# Altium schematic sheet Front.SchDoc
size A; SheetNumber: 1
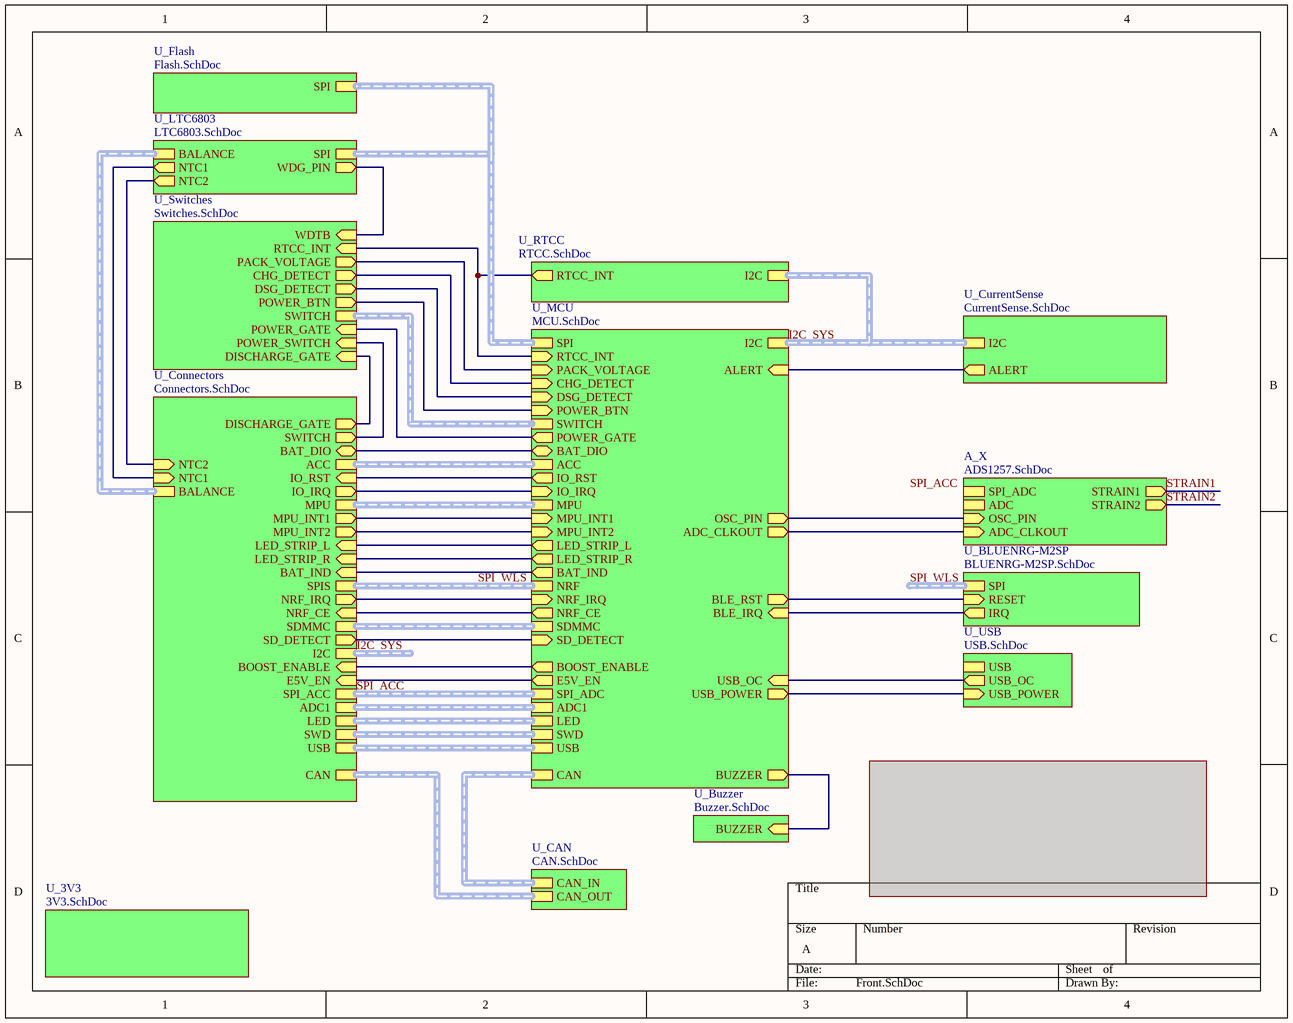
[diagram p0: Front.SchDoc]

## Sub-sheets
A_X = ADS1257.SchDoc: SPI_ADC (harness SPI_ADC), ADC (harness ADC), STRAIN1 (out), STRAIN2 (out), OSC_PIN (in), ADC_CLKOUT (in)
U_3V3 = 3V3.SchDoc: no entries
U_BLUENRG-M2SP = BLUENRG-M2SP.SchDoc: SPI (harness SPI), RESET (in), IRQ (out)
U_Buzzer = Buzzer.SchDoc: BUZZER (in)
U_CAN = CAN.SchDoc: CAN_IN (harness CAN Input), CAN_OUT (harness CAN Output)
U_Connectors = Connectors.SchDoc: SWITCH (out), CAN (harness CAN Output), NTC1 (in), BALANCE (harness Balance), MPU (harness I2C), MPU_INT1 (out), MPU_INT2 (out), LED_STRIP_L (in), LED_STRIP_R (in), SWD (harness SWD), LED (harness LED), IO_RST (in), IO_IRQ (out), NTC2 (in), SPIS (harness SPI), SDMMC (harness SDMMC), SD_DETECT (out), NRF_CE (in), NRF_IRQ (out), SPI_ACC (harness SPI_ADC), BAT_DIO (bidir), USB (harness USB), BAT_IND (in), DISCHARGE_GATE (out), ACC (harness I2C), BOOST_ENABLE (in), E5V_EN (in), I2C (harness I2C), ADC1 (harness ADC)
U_CurrentSense = CurrentSense.SchDoc: ALERT (out), I2C (harness I2C)
U_Flash = Flash.SchDoc: SPI (harness SPI)
U_LTC6803 = LTC6803.SchDoc: SPI (harness SPI), NTC1 (out), BALANCE (harness Balance), NTC2 (out), WDG_PIN (out)
U_MCU = MCU.SchDoc: CHG_DETECT (in), POWER_BTN (in), POWER_GATE (out), USB (harness USB), CAN (harness CAN Input), ACC (harness I2C), SWITCH (harness Switches), I2C (harness I2C), RTCC_INT (in), PACK_VOLTAGE (in), BUZZER (out), SPI_ADC (harness SPI_ADC), ADC1 (harness ADC), MPU (harness I2C), MPU_INT1 (in), MPU_INT2 (in), ALERT (in), SPI, LED_STRIP_L (out), LED_STRIP_R (out), SWD (harness SWD), LED (harness LED), IO_RST (out), IO_IRQ (in), BOOST_ENABLE (out), NRF (harness SPI), DSG_DETECT (in), SDMMC (harness SDMMC), USB_POWER (out), USB_OC (in), SD_DETECT (in), NRF_CE (out), NRF_IRQ (in), OSC_PIN (out), ADC_CLKOUT (out), BAT_DIO (bidir), BAT_IND (out), BLE_RST (out), BLE_IRQ (in), E5V_EN (out)
U_RTCC = RTCC.SchDoc: I2C (harness I2C), RTCC_INT (out)
U_Switches = Switches.SchDoc: POWER_GATE (in), POWER_BTN (out), CHG_DETECT (out), SWITCH (harness Switches), POWER_SWITCH (in), RTCC_INT (in), PACK_VOLTAGE (out), WDTB (in), DSG_DETECT (out), DISCHARGE_GATE (in)
U_USB = USB.SchDoc: USB_POWER (in), USB_OC (out), USB (harness USB)

## Nets
STRAIN1: sheet A_X/STRAIN1
STRAIN2: sheet A_X/STRAIN2
(unnamed): sheet U_MCU/CHG_DETECT, sheet U_Switches/CHG_DETECT
(unnamed): sheet U_MCU/POWER_BTN, sheet U_Switches/POWER_BTN
(unnamed): sheet U_MCU/POWER_GATE, sheet U_Switches/POWER_GATE
(unnamed): sheet U_MCU/RTCC_INT, sheet U_Switches/RTCC_INT, sheet U_RTCC/RTCC_INT
(unnamed): sheet U_MCU/PACK_VOLTAGE, sheet U_Switches/PACK_VOLTAGE
(unnamed): sheet U_MCU/BUZZER, sheet U_Buzzer/BUZZER
(unnamed): sheet U_MCU/MPU_INT1, sheet U_Connectors/MPU_INT1
(unnamed): sheet U_MCU/MPU_INT2, sheet U_Connectors/MPU_INT2
(unnamed): sheet U_MCU/ALERT, sheet U_CurrentSense/ALERT
(unnamed): sheet U_MCU/LED_STRIP_L, sheet U_Connectors/LED_STRIP_L
(unnamed): sheet U_MCU/LED_STRIP_R, sheet U_Connectors/LED_STRIP_R
(unnamed): sheet U_MCU/IO_RST, sheet U_Connectors/IO_RST
(unnamed): sheet U_MCU/IO_IRQ, sheet U_Connectors/IO_IRQ
(unnamed): sheet U_MCU/BOOST_ENABLE, sheet U_Connectors/BOOST_ENABLE
(unnamed): sheet U_MCU/DSG_DETECT, sheet U_Switches/DSG_DETECT
(unnamed): sheet U_MCU/USB_POWER, sheet U_USB/USB_POWER
(unnamed): sheet U_MCU/USB_OC, sheet U_USB/USB_OC
(unnamed): sheet U_MCU/SD_DETECT, sheet U_Connectors/SD_DETECT
(unnamed): sheet U_MCU/NRF_CE, sheet U_Connectors/NRF_CE
(unnamed): sheet U_MCU/NRF_IRQ, sheet U_Connectors/NRF_IRQ
(unnamed): sheet U_MCU/OSC_PIN, sheet A_X/OSC_PIN
(unnamed): sheet U_MCU/ADC_CLKOUT, sheet A_X/ADC_CLKOUT
(unnamed): sheet U_MCU/BAT_DIO, sheet U_Connectors/BAT_DIO
(unnamed): sheet U_MCU/BAT_IND, sheet U_Connectors/BAT_IND
(unnamed): sheet U_MCU/BLE_RST, sheet U_BLUENRG-M2SP/RESET
(unnamed): sheet U_MCU/BLE_IRQ, sheet U_BLUENRG-M2SP/IRQ
(unnamed): sheet U_MCU/E5V_EN, sheet U_Connectors/E5V_EN
(unnamed): sheet U_Switches/POWER_SWITCH, sheet U_Connectors/SWITCH
(unnamed): sheet U_Switches/WDTB, sheet U_LTC6803/WDG_PIN
(unnamed): sheet U_Switches/DISCHARGE_GATE, sheet U_Connectors/DISCHARGE_GATE
(unnamed): sheet U_Connectors/NTC1, sheet U_LTC6803/NTC1
(unnamed): sheet U_Connectors/NTC2, sheet U_LTC6803/NTC2

## Buses and harness runs
harness I2C_SYS = sheet U_Connectors/I2C
harness I2C_SYS = sheet U_CurrentSense/I2C = sheet U_MCU/I2C = sheet U_RTCC/I2C
harness sheet U_CAN/CAN_IN = sheet U_MCU/CAN
harness sheet U_CAN/CAN_OUT = sheet U_Connectors/CAN
harness sheet U_Connectors/ACC = sheet U_MCU/ACC
harness sheet U_Connectors/ADC1 = sheet U_MCU/ADC1
harness sheet U_Connectors/BALANCE = sheet U_LTC6803/BALANCE
harness sheet U_Connectors/LED = sheet U_MCU/LED
harness sheet U_Connectors/MPU = sheet U_MCU/MPU
harness sheet U_Connectors/SDMMC = sheet U_MCU/SDMMC
harness sheet U_Connectors/SWD = sheet U_MCU/SWD
harness sheet U_Connectors/USB = sheet U_MCU/USB
harness sheet U_Flash/SPI = sheet U_LTC6803/SPI = sheet U_MCU/SPI
harness sheet U_MCU/SWITCH = sheet U_Switches/SWITCH
harness SPI_ACC = sheet U_Connectors/SPI_ACC = sheet U_MCU/SPI_ADC
harness SPI_WLS = sheet U_BLUENRG-M2SP/SPI
harness SPI_WLS = sheet U_Connectors/SPIS = sheet U_MCU/NRF

## Notes on the sheet
- Labels drawn without touching a wire or pin: SPI_ACC